# Altium schematic sheet Sheet_1_2021-12-09ad.schdoc
size 307 x 219 mm
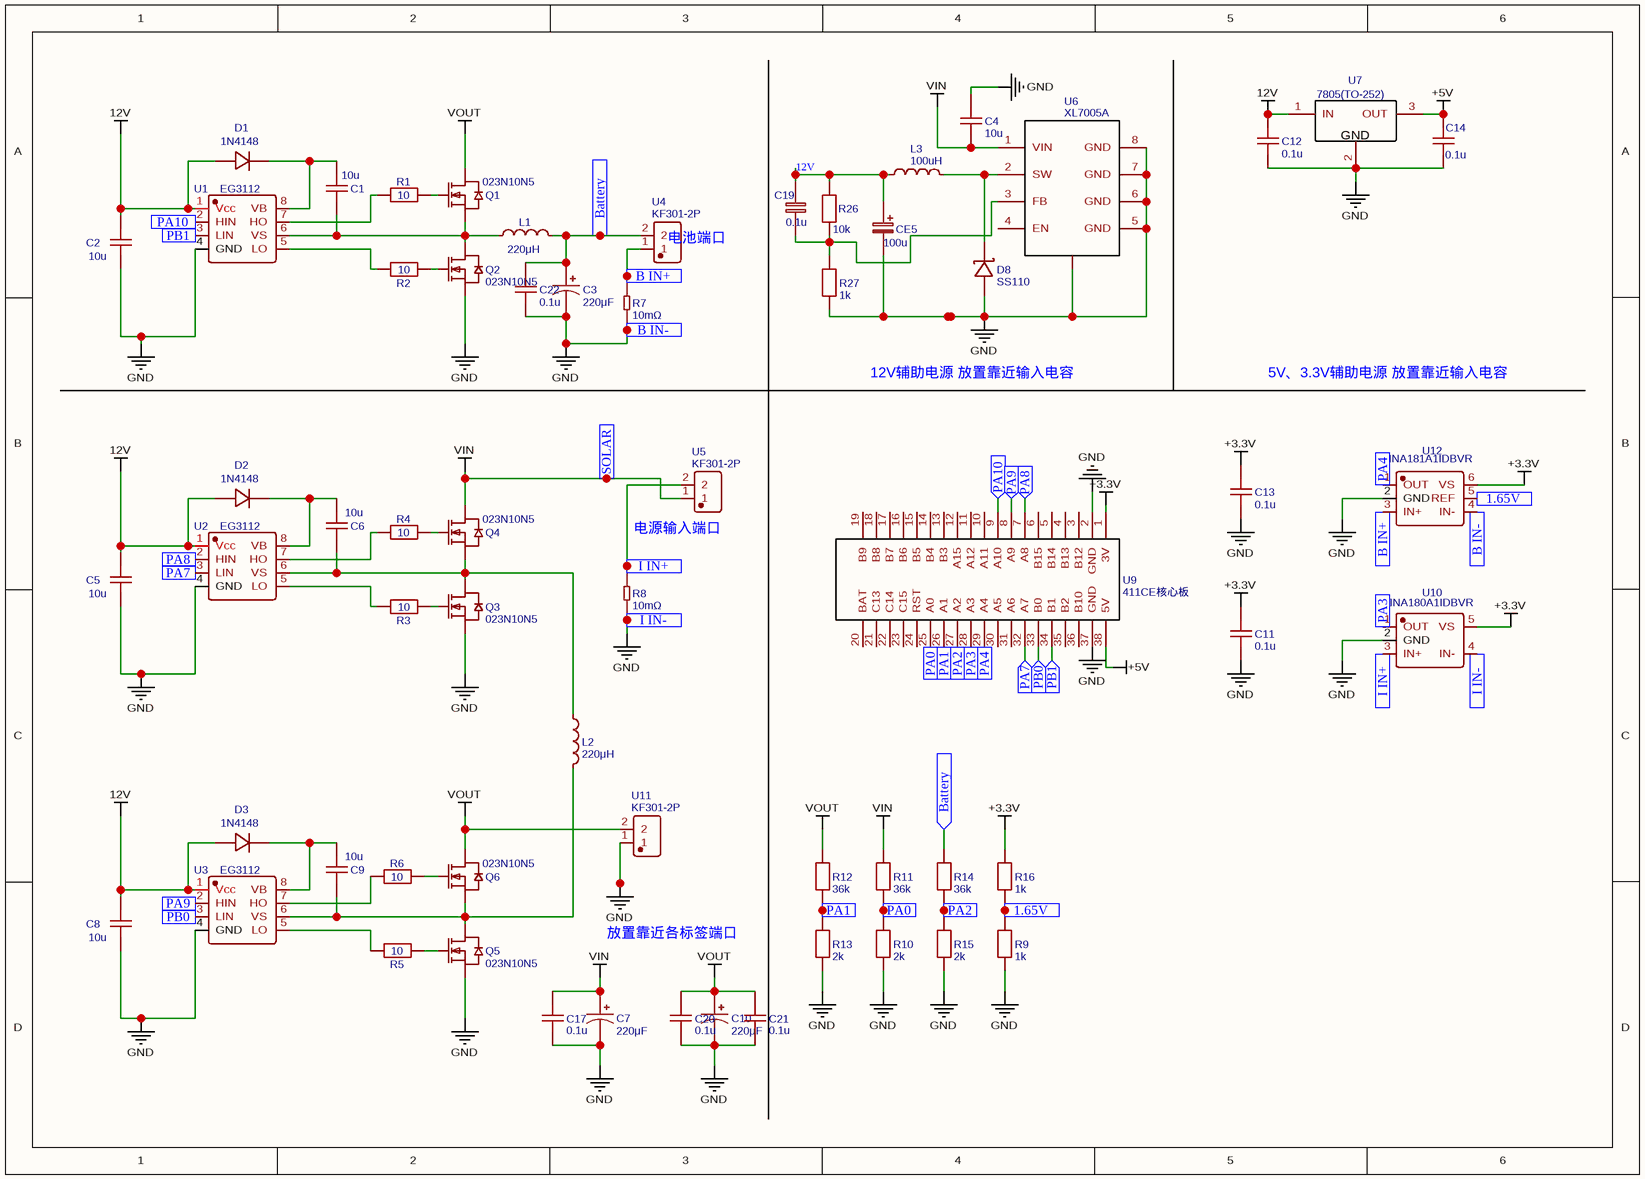
[diagram p0: Sheet_1_2021-12-09ad.schdoc]

## Parts
C1  10u  [C0805]
C2  10u  [C0805]
C3  220μF  [CAP-D12.5-F5.0]
C4  10u  [C1206]
C5  10u  [C0805]
C6  10u  [C0805]
C7  220μF  [CAP-D12.5-F5.0]
C8  10u  [C0805]
C9  10u  [C0805]
C10  220μF  [CAP-D12.5-F5.0]
C11  0.1u  [C0603]
C12  0.1u  [C0805]
C13  0.1u  [C0603]
C14  0.1u  [C0805]
C17  0.1u  [C0805]
C19  0.1u  [C0603]
C20  0.1u  [C0805]
C21  0.1u  [C0805]
C22  0.1u  [C0805]
CE5  100u  [C1206]
D1  1N4148  [SOD-123_L2.8-W1.8-LS3.7-RD]
D2  1N4148  [SOD-123_L2.8-W1.8-LS3.7-RD]
D3  1N4148  [SOD-123_L2.8-W1.8-LS3.7-RD]
D8  SS110  [SMA_L4.3-W2.6-LS5.2-RD]
L1  220μH  [T203125]
L2  220μH  [T203125]
L3  100uH  [IND-SMD_L6.0-W6.0_SWPA6045S]
Q1  023N10N5  [TO-220AB-3_L10.4-W4.6-P2.54-L]
Q2  023N10N5  [TO-220AB-3_L10.4-W4.6-P2.54-L]
Q3  023N10N5  [TO-220AB-3_L10.4-W4.6-P2.54-L]
Q4  023N10N5  [TO-220AB-3_L10.4-W4.6-P2.54-L]
Q5  023N10N5  [TO-220AB-3_L10.4-W4.6-P2.54-L]
Q6  023N10N5  [TO-220AB-3_L10.4-W4.6-P2.54-L]
R1  10  [R0603]
R2  10  [R0603]
R3  10  [R0603]
R4  10  [R0603]
R5  10  [R0603]
R6  10  [R0603]
R7  10mΩ  [R2512]
R8  10mΩ  [R2512]
R9  1k  [R0603]
R10  2k  [R0603]
R11  36k  [R0603]
R12  36k  [R0603]
R13  2k  [R0603]
R14  36k  [R0603]
R15  2k  [R0603]
R16  1k  [R0603]
R26  10k  [R0603]
R27  1k  [R0603]
U1  EG3112  [SOIC-8_L4.9-W3.9-P1.27-LS6.0-BL]
U2  EG3112  [SOIC-8_L4.9-W3.9-P1.27-LS6.0-BL]
U3  EG3112  [SOIC-8_L4.9-W3.9-P1.27-LS6.0-BL]
U4  KF301-2P  [KF301-5.0-2P]
U5  KF301-2P  [KF301-5.0-2P]
U6  XL7005A  [SOIC-8_L5.0-W4.0-P1.27-LS6.0-BL-EP2.0]
U7  7805(TO-252)  [PG-TO252-3_L6.6-W6.0-P4.56-LS10.0-BR-CW]
U9  411CE核心板  [STM32F411CE核心板 扣插]
U10  INA180A1IDBVR  [SOT-23-5_L3.0-W1.7-P0.95-LS2.8-BR]
U11  KF301-2P  [KF301-5.0-2P]
U12  INA181A1IDBVR  [SOT-23-6_L2.9-W1.6-P0.95-LS2.8-TL]

## Ports
1.65V (in), B IN+ (in), B IN- (in), Battery (in), I IN+ (in), I IN- (in), PA0 (in), PA1 (in), PA2 (in), PA3 (in), PA4 (in), PA7 (in), PA8 (in), PA9 (in), PA10 (in), PB0 (in), PB1 (in), SOLAR (in)

## Nets
12V: C2.1 C5.1 C8.1 C12.2 C19.1 CE5.1 D1.2(A) D2.2(A) D3.2(A) L3.1 R26.2 U1.1(Vcc) U2.1(Vcc) U3.1(Vcc) U7.1(IN)
+3.3V: C11.2 C13.2 R16.2 U9.1(3V) U10.5(VS) U12.6(VS)
+5V: C14.2 U7.3(OUT) U9.38(5V)
GND: C2.2 C3.2 C4.2 C5.2 C7.2 C8.2 C10.2 C11.1 C12.1 C13.1 C14.1 C17.1 C20.1 C21.1 C22.1 CE5.2 D8.2(A) Q2.3(S) Q3.3(S) Q5.3(S) R7.1 R8.1 R9.1 R10.1 R13.1 R15.1 R27.1 U1.4(GND) U2.4(GND) U3.4(GND) U6.5(GND) U6.6(GND) U6.7(GND) U6.8(GND) U6.9 U7.2(GND) U9.2(GND) U9.37(GND) U10.2(GND) U10.4(IN-) U11.1 U12.2(GND) U12.4(IN-) ; port B IN-, port I IN-
VIN: C4.1 C7.1 C17.2 Q4.2(D) R11.2 U5.1 U6.1(VIN) ; port SOLAR
VOUT: C10.1 C20.2 C21.2 Q1.2(D) Q6.2(D) R12.2 U11.2
1.65V: R9.2 R16.1 U12.5(REF) ; port 1.65V
B IN+: R7.2 U4.1 U12.3(IN+) ; port B IN+
Battery: C3.1 C22.2 L1.2 R14.2 U4.2 ; port Battery
I IN+: R8.2 U5.2 U10.3(IN+) ; port I IN+
PA0: R10.2 R11.1 U9.25(A0) ; port PA0
PA1: R12.1 R13.2 U9.26(A1) ; port PA1
PA2: R14.1 R15.2 U9.27(A2) ; port PA2
PA3: U9.28(A3) U10.1(OUT) ; port PA3
PA4: U9.29(A4) U12.1(OUT) ; port PA4
PA7: U2.3(LIN) U9.32(A7) ; port PA7
PA8: U2.2(HIN) U9.7(A8) ; port PA8
PA9: U3.2(HIN) U9.8(A9) ; port PA9
PA10: U1.2(HIN) U9.9(A10) ; port PA10
PB0: U3.3(LIN) U9.33(B0) ; port PB0
PB1: U1.3(LIN) U9.34(B1) ; port PB1
NetC1_1: C1.1 L1.1 Q1.3(S) Q2.2(D) U1.6(VS)
NetC1_2: C1.2 D1.1(C) U1.8(VB)
NetC6_1: C6.1 L2.1 Q3.2(D) Q4.3(S) U2.6(VS)
NetC6_2: C6.2 D2.1(C) U2.8(VB)
NetC9_1: C9.1 L2.2 Q5.2(D) Q6.3(S) U3.6(VS)
NetC9_2: C9.2 D3.1(C) U3.8(VB)
NetC19_2: C19.2 R26.1 R27.2 U6.3(FB)
NetD8_1: D8.1(K) L3.2 U6.2(SW)
NetQ1_1: Q1.1(G) R1.2
NetQ2_1: Q2.1(G) R2.2
NetQ3_1: Q3.1(G) R3.2
NetQ4_1: Q4.1(G) R4.2
NetQ5_1: Q5.1(G) R5.2
NetQ6_1: Q6.1(G) R6.2
NetR1_1: R1.1 U1.7(HO)
NetR2_1: R2.1 U1.5(LO)
NetR3_1: R3.1 U2.5(LO)
NetR4_1: R4.1 U2.7(HO)
NetR5_1: R5.1 U3.5(LO)
NetR6_1: R6.1 U3.7(HO)

Not connected (* = marked no-connect by the designer): U6 4(EN); U9 3(B12) 4(B13) 5(B14) 6(B15) 10(A11) 11(A12) 12(A15) 13(B3) 14(B4) 15(B5) 16(B6) 17(B7) 18(B8) 19(B9) 20(BAT) 21(C13) 22(C14) 23(C15) 24(RST) 30(A5) 31(A6) 35(B2) 36(B10)

## Notes on the sheet
- (near U4) 电池端口
- 12V辅助电源 放置靠近输入电容
- 5V、3.3V辅助电源 放置靠近输入电容
- (near U5) 电源输入端口
- 放置靠近各标签端口

## Library data of the parts
C1 C2 C4-C6 C8 C9 = 10u: nameAlias: Value(F); Contributor: LCEDA_Lib; spicePre: C; spiceSymbolName: C_0805_US
C3 C7 C10 = 220μF: nameAlias: Value(F); Contributor: LCEDA_Lib; Package Display: No; spicePre: C; spiceSymbolName: CE_TH_D10.0×F5.0_US
C11-C14 C17 C19-C22 = 0.1u: nameAlias: Value(F); Contributor: LCEDA_Lib; spicePre: C
  C11 C13 C17 C20-C22: spiceSymbolName: C_0603_US
  C12 C14: spiceSymbolName: C_0805_US
  C19: spiceSymbolName: C_0805_EU
CE5 = 100u: nameAlias: Value(F); Contributor: LCEDA_Lib; spicePre: C; spiceSymbolName: CE_TH_D10.0×F5.0_EU
D1-D3 = 1N4148: BOM_Manufacturer: Slkor(SLKORMICRO Elec.); BOM_Manufacturer Part: 1N4148W; Contributor: LCSC; BOM_Supplier: LCSC; BOM_Supplier Part: C444720; BOM_JLCPCB Part Class: Extended Part; spicePre: D; spiceSymbolName: 1N4148W_C444720
D8 = SS110: BOM_Manufacturer: MDD; BOM_Supplier: LCSC; BOM_Manufacturer Part: SS110; BOM_Supplier Part: C2482; BOM_JLCPCB Part Class: Extended Part; spicePre: D; spiceSymbolName: SS110
L1 L2 = 220μH: Contributor: longabc; spicePre: L; spiceSymbolName: T203125立式
L3 = 100uH: BOM_Manufacturer: Sunlord; BOM_Manufacturer Part: SWPA6045S101MT; nameAlias: Inductance; BOM_Supplier: LCSC; BOM_Supplier Part: C60633; BOM_JLCPCB Part Class: Extended Part; spicePre: L; spiceSymbolName: SWPA6045S101MT
Q1-Q6 = 023N10N5: BOM_Manufacturer: HTCSEMI(海天芯); BOM_Manufacturer Part: HT75NF75ASZ; Contributor: LCSC; BOM_Supplier: LCSC; BOM_Supplier Part: C2874954; spicePre: Q; spiceSymbolName: HT75NF75ASZ
R1-R6 = 10: nameAlias: Value(Ω); Contributor: LCEDA_Lib; spicePre: R; spiceSymbolName: R_AXIAL-1.0_EU
R9 R16 R27 = 1k: nameAlias: Value(Ω); Contributor: LCEDA_Lib; spicePre: R
  R9 R16: spiceSymbolName: R_0603_EU
  R27: spiceSymbolName: R_0805_EU
R10 R13 R15 = 2k: nameAlias: Value(Ω); Contributor: LCEDA_Lib; spicePre: R; spiceSymbolName: R_0603_EU
R11 R12 R14 = 36k: nameAlias: Value(Ω); Contributor: LCEDA_Lib; spicePre: R; spiceSymbolName: R_0603_EU
R26 = 10k: nameAlias: Value(Ω); Contributor: LCEDA_Lib; spicePre: R; spiceSymbolName: R_0805_EU
U1-U3 = EG3112: BOM_Manufacturer: EG Micro; Contributor: LCSC; BOM_Supplier: LCSC; BOM_Supplier Part: C383538; BOM_Manufacturer Part: EG3112; BOM_JLCPCB Part Class: Extended Part; spicePre: U; spiceSymbolName: EG3112_C383538
U4 U5 U11 = KF301-2P: Contributor: fcyt1234567; spicePre: U; spiceSymbolName: KF301-2P
U6 = XL7005A: BOM_Manufacturer: XLSEMI; BOM_Supplier: LCSC; BOM_Manufacturer Part: XL7005A; BOM_Supplier Part: C50848; BOM_JLCPCB Part Class: Extended Part; spicePre: U; spiceSymbolName: XL7005A
U7 = 7805(TO-252): BOM_Manufacturer: STMicroelectronics; BOM_Manufacturer Part: L7805CV-DG; Contributor: LCEDA_Lib; BOM_Supplier: LCSC; BOM_Supplier Part: C3795; spicePre: U; spiceSymbolName: 7805(TO-220)
U9 = 411CE核心板: Contributor: lhnp149147; spicePre: U; spiceSymbolName: 411CE核心板
U10 = INA180A1IDBVR: BOM_Manufacturer: Texas Instruments; Contributor: LCSC; BOM_Supplier: LCSC; BOM_Supplier Part: C122228; BOM_Manufacturer Part: INA180A1IDBVR; BOM_JLCPCB Part Class: Extended Part; spicePre: U; spiceSymbolName: INA180A1IDBVR
U12 = INA181A1IDBVR: BOM_Manufacturer: TI(德州仪器); Contributor: LCSC; BOM_Supplier: LCSC; BOM_Supplier Part: C2058943; BOM_Manufacturer Part: INA181A1IDBVR; BOM_JLCPCB Part Class: Extended Part; spicePre: U; spiceSymbolName: INA181A1IDBVR
R7 R8 = 10mΩ: spicePre: R; spiceSymbolName: R-2512